# Altium schematic sheet main.SchDoc
size A3; SheetNumber: 1; SheetTotal: 2
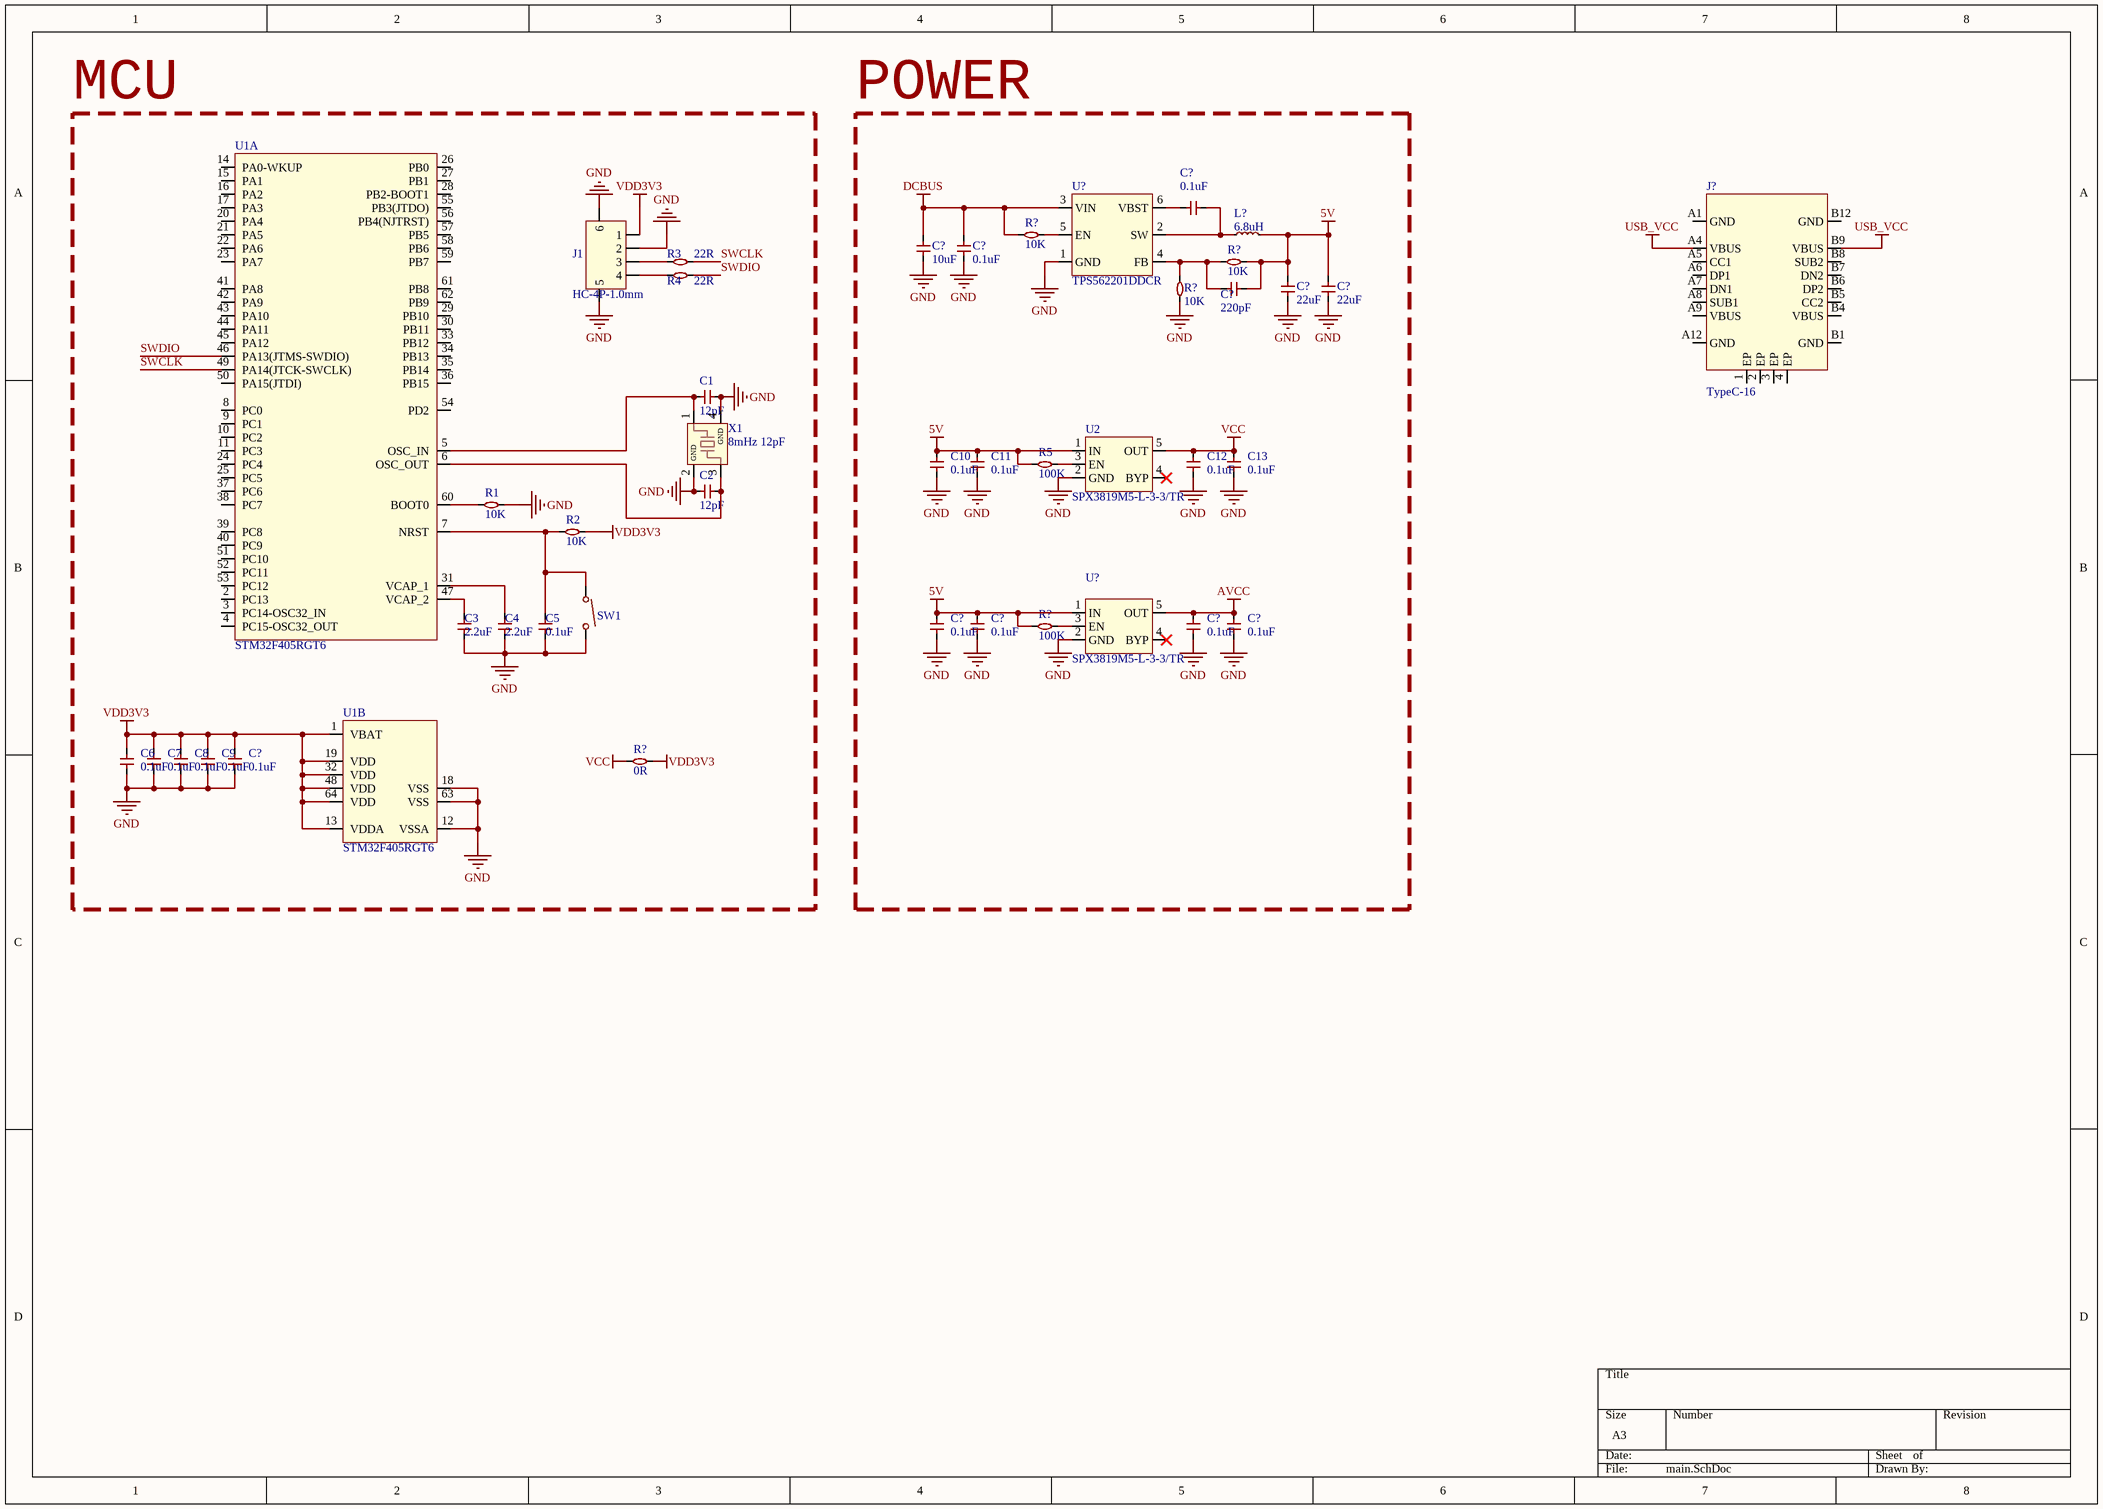
[diagram p0: main.SchDoc]

## Parts
(Parts that share a designator on the sheet are numbered #1, #2 ... from top to bottom, then left to right.)
C1  12pF  [C0402]
C2  12pF  [C0402]
C3  2.2uF  [C0402]
C4  2.2uF  [C0402]
C5  0.1uF  [C0402]
C6  0.1uF  [C0402]
C7  0.1uF  [C0402]
C8  0.1uF  [C0402]
C9  0.1uF  [C0402]
C10  0.1uF  [C0402]
C11  0.1uF  [C0402]
C12  0.1uF  [C0402]
C13  0.1uF  [C0402]
C?#1  0.1uF  [C0402]
C?#2  10uF  [C0402]
C?#3  0.1uF  [C0402]
C?#4  220pF  [C0402]
C?#5  22uF  [C0402]
C?#6  22uF  [C0402]
C?#7  0.1uF  [C0402]
C?#8  0.1uF  [C0402]
C?#9  0.1uF  [C0402]
C?#10  0.1uF  [C0402]
C?#11  0.1uF  [C0402]
J1  HC-4P-1.0mm
J?  TypeC-16  [USB-C-SMD_KH-TYPE-C-16P]
L?  6.8uH
R1  10K  [R0402_1]
R2  10K  [R0402_1]
R3  22R  [R0402_1]
R4  22R  [R0402_1]
R5  100K  [R0402_1]
R?#1  10K  [R0402_1]
R?#2  10K  [R0402_1]
R?#3  10K  [R0402_1]
R?#4  100K  [R0402_1]
R?#5  0R  [R0402_1]
SW1  3*4两脚按键  [SW-SMD_L4.0-W2.9-LS5.0]  (value not drawn)
U1  STM32F405RGT6  [LQFP-64_L10.0-W10.0-P0.50]  (parts A,B of 2)
U2  SPX3819M5-L-3-3/TR  [SOT-23-5_L3.0-W1.7-P0.95-LS2.8-BR]
U?#1  TPS562201DDCR
U?#2  SPX3819M5-L-3-3/TR  [SOT-23-5_L3.0-W1.7-P0.95-LS2.8-BR]
X1  8mHz 12pF

## Blocks framed on the sheet
MCU: C1-C9 C?#11 J1 R1-R4 R?#5 SW1 U1 X1
POWER: C10-C13 C?#1-C?#10 L? R5 R?#1-R?#4 U2 U?#1 U?#2

## Nets
5V: C10.1 C11.1 C?#4.2 C?#5.1 C?#6.1 C?#7.1 C?#8.1 L?.2 R5.2 R?#2.2 R?#4.2 U2.1(IN) U?#2.1(IN)
AVCC: C?#9.1 C?#10.1 U?#2.5(OUT)
DCBUS: C?#2.1 C?#3.1 R?#1.1 U?#1.3(VIN)
GND: C1.2 C2.2 C3.2 C4.2 C5.1 C6.2 C7.2 C8.2 C9.2 C10.2 C11.2 C12.2 C13.2 C?#2.2 C?#3.2 C?#5.2 C?#6.2 C?#7.2 C?#8.2 C?#9.2 C?#10.2 C?#11.2 J1.2 J1.5 J1.6 R1.2 R?#3.1 SW1.2 U1.12(VSSA) U1.18(VSS) U1.63(VSS) U2.2(GND) U?#1.1(GND) U?#2.2(GND) X1.2(GND) X1.4(GND)
USB_VCC: J?.A4(VBUS) J?.B9(VBUS)
VCC: C12.1 C13.1 R?#5.1 U2.5(OUT)
VDD3V3: C6.1 C7.1 C8.1 C9.1 C?#11.1 J1.1 R2.2 R?#5.2 U1.1(VBAT) U1.13(VDDA) U1.19(VDD) U1.32(VDD) U1.48(VDD) U1.64(VDD)
SWCLK: R3.2 U1.49(PA14(JTCK-SWCLK))
SWDIO: R4.2 U1.46(PA13(JTMS-SWDIO))
NetC1_1: C1.1 U1.5(OSC_IN) X1.1
NetC2_1: C2.1 U1.6(OSC_OUT) X1.3
NetC3_1: C3.1 U1.47(VCAP_2)
NetC4_1: C4.1 U1.31(VCAP_1)
NetC5_2: C5.2 R2.1 SW1.1 U1.7(NRST)
NetC?#1_1: C?#1.1 L?.1 U?#1.2(SW)
NetC?#1_2: C?#1.2 U?#1.6(VBST)
NetC?#4_1: C?#4.1 R?#2.1 R?#3.2 U?#1.4(FB)
NetJ1_3: J1.3 R3.1
NetJ1_4: J1.4 R4.1
NetR1_1: R1.1 U1.60(BOOT0)
NetR5_1: R5.1 U2.3(EN)
NetR?#1_2: R?#1.2 U?#1.5(EN)
NetR?#4_1: R?#4.1 U?#2.3(EN)

Not connected (* = marked no-connect by the designer): J? 1(EP) 2(EP) 3(EP) 4(EP) A1(GND) A5(CC1) A6(DP1) A7(DN1) A8(SUB1) A9(VBUS) A12(GND) B1(GND) B4(VBUS) B5(CC2) B6(DP2) B7(DN2) B8(SUB2) B12(GND); U1 2(PC13) 3(PC14-OSC32_IN) 4(PC15-OSC32_OUT) 8(PC0) 9(PC1) 10(PC2) 11(PC3) 14(PA0-WKUP) 15(PA1) 16(PA2) 17(PA3) 20(PA4) 21(PA5) 22(PA6) 23(PA7) 24(PC4) 25(PC5) 26(PB0) 27(PB1) 28(PB2-BOOT1) 29(PB10) 30(PB11) 33(PB12) 34(PB13) 35(PB14) 36(PB15) 37(PC6) 38(PC7) 39(PC8) 40(PC9) 41(PA8) 42(PA9) 43(PA10) 44(PA11) 45(PA12) 50(PA15(JTDI)) 51(PC10) 52(PC11) 53(PC12) 54(PD2) 55(PB3(JTDO)) 56(PB4(NJTRST)) 57(PB5) 58(PB6) 59(PB7) 61(PB8) 62(PB9); U2 4(BYP)*; U?#2 4(BYP)*

## Library data of the parts
C1-C13 C?#1-C?#11 = CAP: 贴片电容; Manufacturer: SAMSUNG(三星); Manufacturer Part: CL05A105KP5NNND; Add into BOM: yes; Tolerance: ±10%; Voltage Rated: 10V; Temperature Coefficient: X5R; Symbol: CAP-0402; Device: cap-0402; LCSC Part Name: 1uF ±10% 10V; Supplier Part: C307414; Supplier Footprint: 0402; JLCPCB Part Class: Extended Part; Datasheet: https://atta.szlcsc.com/upload/public/pdf/source/20181009/C307414_0A02B57115E94FED95F0CB1E32115BFC.pdf; Supplier: LCSC; Convert to PCB: yes
J1 = HC-4P-1.0mm: 线对板连接器
J? = TypeC-16P: Type-C母座; 触点数量:16; Manufacturer: kinghelm(金航标); Symbol: KH-TYPE-C-16P; Add into BOM: yes; Connector Type: Type-C; Gender: 母座; Number of Contacts: 16; Number of Ports: 1; Current Rating - Power (Max): 3A; LCSC Part Name: Type-C 母座 卧贴; Supplier Part: C709357; Manufacturer Part: KH-TYPE-C-16P; Supplier Footprint: SMD; Datasheet: https://atta.szlcsc.com/upload/public/pdf/source/20200911/C709357_AA8DCEB38BB20E3035A7ED7AE7667837.pdf; Supplier: LCSC; Convert to PCB: yes; Standard: -; Mounting Style: 卧贴; Operating Temperature Range: -40~+85; JLCPCB Part Class: Extended Part
L? = IND: 贴片电感
R1-R5 R?#1-R?#5 = RES: 贴片电阻; Manufacturer: UNI-ROYAL(厚声); Manufacturer Part: 0402WGF1001TCE; Add into BOM: yes; Tolerance: ±1%; Power(Watts): 1/16W; Temperature Coefficient: ±100ppm/; Overload Voltage (Max): 50V; Symbol: RES-0402; Device: res-0402; LCSC Part Name: 1k ±1%; Supplier Part: C11702; Supplier Footprint: 0402; Datasheet: https://atta.szlcsc.com/upload/public/pdf/source/20200306/C422600_1E6D84923E4A46A82E41ADD87F860B5C.pdf; Supplier: LCSC; Convert to PCB: yes; Type: 厚膜电阻; Operating Temperature Range: -55~+155; JLCPCB Part Class: 基础库
SW1 = Switch: 3*4两脚贴片不带柱; Manufacturer: BRIGHT(博瑞泰); Symbol: TSA343G00-250J2; Device: 3*4两脚按键不带柱; Add into BOM: yes; Contact Current: 50mA; Voltage Rating (DC): 12V; Insulation Resistance: 100M; Circuit: 单刀单掷; Actuator Style: 圆形按钮; Actuator/Cap Color: 黑色; With Lamp: 无; Operating Force: 250gf@±50gf; Mechanical Life: 50000; Pin Style: SMD接片; Switch Length: 3.95mm; Switch Width: 2.9mm; Switch Height: 2mm; Strike Gundam: 否; LCSC Part Name: 3*4 两脚小龟不带柱  250gf; Supplier Part: C354946; Manufacturer Part: TSA343G00-250J2; Supplier Footprint: SMD; Datasheet: https://atta.szlcsc.com/upload/public/pdf/source/20190426/C354946_6B70DFBDFA823D17B8EB46FB9599F693.pdf; Supplier: LCSC; Convert to PCB: yes; Mounting Style: 立贴; Operating Temperature: -25~+70; JLCPCB Part Class: Extended Part
U1 = STM32F405RGT6: ST,MCU,CPU内核：ARM Cortex-M4 CPU最大主频：168MHz 程序存储容量：512KB 程序存储器类型：FLASH RAM总容量：192KB
U2 U?#2 = SPX3819M5-L-3-3/TR: LDO输入电压:16V;输出电压:3.3V; Manufacturer: MaxLinear; Add into BOM: yes; Output Type: 固定; Output Polarity: 正; Number of Outputs: 1; Maximum Input Voltage: 16V; Output Voltage: 3.3V; Dropout Voltage: 700mV@(500mA); Output Current: 500mA; Power Supply Rejection Ratio (PRSS): 70dB; Symbol: SPX3819M5-L-3-3/TR; LCSC Part Name: Vin=16V Vout=3.3V 500mA 70dB; Supplier Part: C9055; Manufacturer Part: SPX3819M5-L-3-3/TR; Supplier Footprint: SOT-23-5; Datasheet: https://atta.szlcsc.com/upload/public/pdf/source/20160421/1461205045150.pdf; Supplier: LCSC; Convert to PCB: yes; JLCPCB Part Class: Extended Part
U?#1 = TPS562201DDCR: DCDC,输入4.5~17V 输出768mV~7V， 2A
X1 = XTAL: 无源晶振  频率公差：±10ppm